# Altium schematic sheet Power section.SchDoc: 3x_VCO_board
size A3; Author: Jakub Orzechowski; Revision: 1.0; SheetNumber: 1; SheetTotal: 4
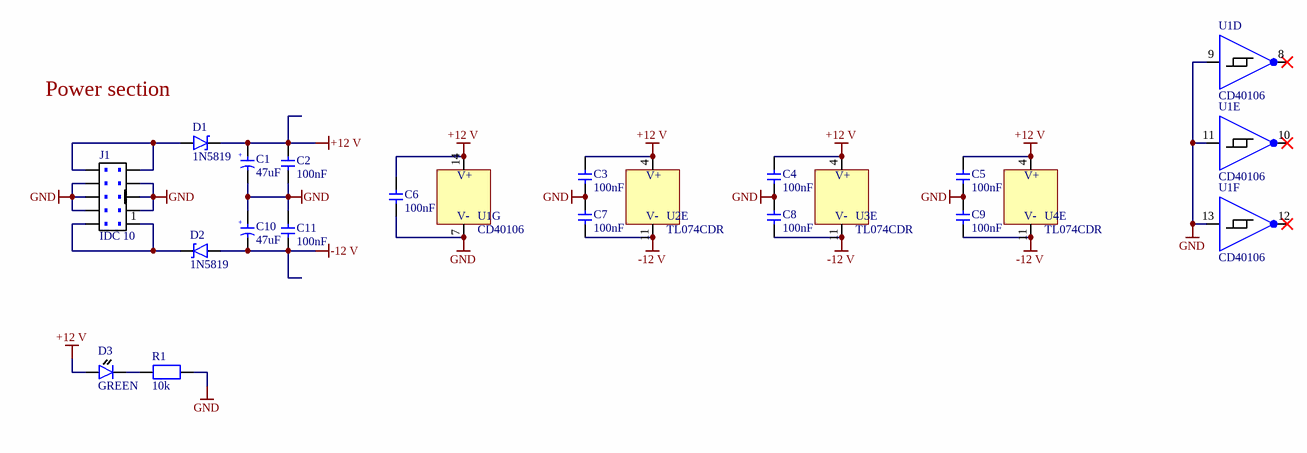
[diagram p0: Power section.SchDoc]

## Parts
C1  value 47uF  [Cap electrolytic THT 5mm]  (hidden comment: CAP)
C2  value 100nF  [Cap SMD 0805]  (hidden comment: CAP)
C3  value 100nF  [Cap SMD 0805]  (hidden comment: CAP)
C4  value 100nF  [Cap SMD 0805]  (hidden comment: CAP)
C5  value 100nF  [Cap SMD 0805]  (hidden comment: CAP)
C6  value 100nF  [Cap SMD 0805]  (hidden comment: CAP)
C7  value 100nF  [Cap SMD 0805]  (hidden comment: CAP)
C8  value 100nF  [Cap SMD 0805]  (hidden comment: CAP)
C9  value 100nF  [Cap SMD 0805]  (hidden comment: CAP)
C10  value 47uF  [Cap electrolytic THT 5mm]  (hidden comment: CAP)
C11  value 100nF  [Cap SMD 0805]  (hidden comment: CAP)
D1  Model: 1N5819  [Diode THT 10 mm]  (hidden comment: SCHOTTKY)
D2  Model: 1N5819  [Diode THT 10 mm]  (hidden comment: SCHOTTKY)
D3  Color: GREEN  [LED SMD 0805]  (hidden comment: LED)
J1  IDC 10  [IDC 10 PIN]
R1  value 10k  [Resistor SMD 0805]  (hidden comment: RES)
U1  CD40106  [DIP-14 socket]  (parts D,E,F,G of 7)
U2  TL074CDR  [SOIC14]  (part E of 5)
U3  TL074CDR  [SOIC14]  (part E of 5)
U4  TL074CDR  [SOIC14]  (part E of 5)

## Nets
+12 V: C1.2 C2.2 C3.2 C4.2 C5.2 C6.2 D1.2 D3.1 U1.14 U2.4 U3.4 U4.4
-12 V: C7.1 C8.1 C9.1 C10.1 C11.1 D2.1 U2.11 U3.11 U4.11
GND: C1.1 C2.1 C3.1 C4.1 C5.1 C6.1 C7.2 C8.2 C9.2 C10.2 C11.2 J1.3 J1.4 J1.5 J1.6 J1.7 J1.8 R1.2 U1.7 U1.9 U1.11 U1.13
NetD1_1: D1.1 J1.9 J1.10
NetD2_2: D2.2 J1.1 J1.2
NetD3_2: D3.2 R1.1

Not connected (* = marked no-connect by the designer): U1 8* 10* 12*

## Notes on the sheet
- (near D1) Power section
- PROJECT:
- SCHEMATIC:
- REV:
- DRAWN BY:
- DATE:
- FILENAME:
- SHEET:
- out of
- (in symbol Capacitor Electr THT 5mm) +
- (in symbol CD40106 DIP-14, part G) V+; V-
- (in symbol TL074CDR SOIC14, part E) V+; V-

## Library data of the parts
C1 C10 = Capacitor Electr THT 5mm: THT Electrolytic Capacitor 5 mm Diameter; Voltage rating: *; Tolerance: *; Package Type: THT
C2-C9 C11 = Capacitor SMD 0805: SMD Capacitor Non-Polarised 0805 Package; Voltage rating: *; Tolerance: *; Package Type: SMD
D1 D2 = Schottky Diode THT: Generic THT Axial Schottky Diode 10 mm Pitch; Max Reverse Voltage: *; Max Current: *; Package Type: THT; Type: Schottky
D3 = LED SMD: SMD LED Diode 0805 Package; Forward voltage: *; Package Type: SMD; Type: LED
J1 = IDC 10 pin: 10 Pin IDC Connector
R1 = Resistor SMD 0805: SMD Resistor 0805 package; Tolerance: *; Package Type: SMD
U1 = CD40106 DIP-14: CD40106 Hex Schmitt Trigger Inverter DIP-14 Package; Type: Schmitt Trigger; Package Type: THT; Package: DIP-14
U2-U4 = TL074CDR SOIC14: TL074CDR Quad Op-Amp SOIC14 Package; Type: Op Amp; Package Type: SMD; Package: SOIC14